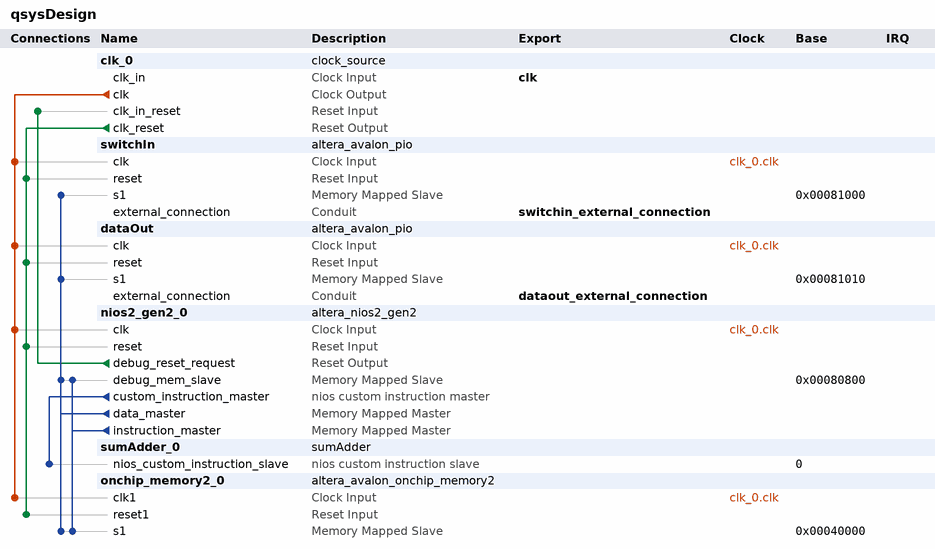
[diagram p0: system contents]
# Platform Designer (Qsys) system qsysDesign, Cyclone V 5CEBA4F23C7
# Parameters at their usual value, and those the tool derives, are not listed.
package require -exact qsys 20.1
create_system qsysDesign
set_project_property DEVICE_FAMILY {Cyclone V}
set_project_property DEVICE 5CEBA4F23C7

add_instance clk_0 clock_source 20.1
set_instance_parameter_value clk_0 clockFrequency 50000000

add_instance switchIn altera_avalon_pio 20.1
set_instance_parameter_value switchIn direction Input
set_instance_parameter_value switchIn width 8

add_instance dataOut altera_avalon_pio 20.1
set_instance_parameter_value dataOut direction Output
set_instance_parameter_value dataOut width 16

add_instance nios2_gen2_0 altera_nios2_gen2 20.1
set_instance_parameter_value nios2_gen2_0 dcache_size 2048
set_instance_parameter_value nios2_gen2_0 exceptionSlave onchip_memory2_0.s1
set_instance_parameter_value nios2_gen2_0 icache_size 4096
set_instance_parameter_value nios2_gen2_0 impl Tiny
set_instance_parameter_value nios2_gen2_0 resetSlave onchip_memory2_0.s1

add_instance sumAdder_0 sumAdder 1.0

add_instance onchip_memory2_0 altera_avalon_onchip_memory2 20.1
set_instance_parameter_value onchip_memory2_0 dataWidth 32
set_instance_parameter_value onchip_memory2_0 dualPort false
set_instance_parameter_value onchip_memory2_0 initMemContent true
set_instance_parameter_value onchip_memory2_0 initializationFileName onchip_mem.hex
set_instance_parameter_value onchip_memory2_0 memorySize 200000

# connections
add_connection clk_0.clk dataOut.clk clock
add_connection clk_0.clk nios2_gen2_0.clk clock
add_connection clk_0.clk onchip_memory2_0.clk1 clock
add_connection clk_0.clk switchIn.clk clock
add_connection clk_0.clk_reset dataOut.reset reset
add_connection clk_0.clk_reset nios2_gen2_0.reset reset
add_connection clk_0.clk_reset onchip_memory2_0.reset1 reset
add_connection clk_0.clk_reset switchIn.reset reset
add_connection nios2_gen2_0.debug_reset_request clk_0.clk_in_reset reset
add_connection nios2_gen2_0.data_master dataOut.s1 avalon
set_connection_parameter_value nios2_gen2_0.data_master/dataOut.s1 baseAddress 0x00081010
add_connection nios2_gen2_0.data_master nios2_gen2_0.debug_mem_slave avalon
set_connection_parameter_value nios2_gen2_0.data_master/nios2_gen2_0.debug_mem_slave baseAddress 0x00080800
add_connection nios2_gen2_0.data_master onchip_memory2_0.s1 avalon
set_connection_parameter_value nios2_gen2_0.data_master/onchip_memory2_0.s1 baseAddress 0x00040000
add_connection nios2_gen2_0.data_master switchIn.s1 avalon
set_connection_parameter_value nios2_gen2_0.data_master/switchIn.s1 baseAddress 0x00081000
add_connection nios2_gen2_0.instruction_master nios2_gen2_0.debug_mem_slave avalon
set_connection_parameter_value nios2_gen2_0.instruction_master/nios2_gen2_0.debug_mem_slave baseAddress 0x00080800
add_connection nios2_gen2_0.instruction_master onchip_memory2_0.s1 avalon
set_connection_parameter_value nios2_gen2_0.instruction_master/onchip_memory2_0.s1 baseAddress 0x00040000
add_connection nios2_gen2_0.custom_instruction_master sumAdder_0.nios_custom_instruction_slave nios_custom_instruction
set_connection_parameter_value nios2_gen2_0.custom_instruction_master/sumAdder_0.nios_custom_instruction_slave CIName sumadder_0
set_connection_parameter_value nios2_gen2_0.custom_instruction_master/sumAdder_0.nios_custom_instruction_slave baseAddress 0

# exported interfaces
add_interface clk clock sink
set_interface_property clk EXPORT_OF clk_0.clk_in
add_interface dataout_external_connection conduit end
set_interface_property dataout_external_connection EXPORT_OF dataOut.external_connection
add_interface switchin_external_connection conduit end
set_interface_property switchin_external_connection EXPORT_OF switchIn.external_connection

set_interconnect_requirement {$system} qsys_mm.clockCrossingAdapter HANDSHAKE
set_interconnect_requirement {$system} qsys_mm.enableEccProtection FALSE
set_interconnect_requirement {$system} qsys_mm.insertDefaultSlave FALSE
set_interconnect_requirement {$system} qsys_mm.maxAdditionalLatency 1

save_system qsysDesign.qsys
